# EasyEDA Pro project LT1568滤波器.eprj

# Schematic Schematic1
Board Name: Board1; Create Date: 2025-03-19; Page Name: P1; Project Name: LT1568滤波器; Schematic Name: Schematic1; Update Date: 2025-03-26; Company: 嘉立创EDA; Page Size: A4; Version: V1.0
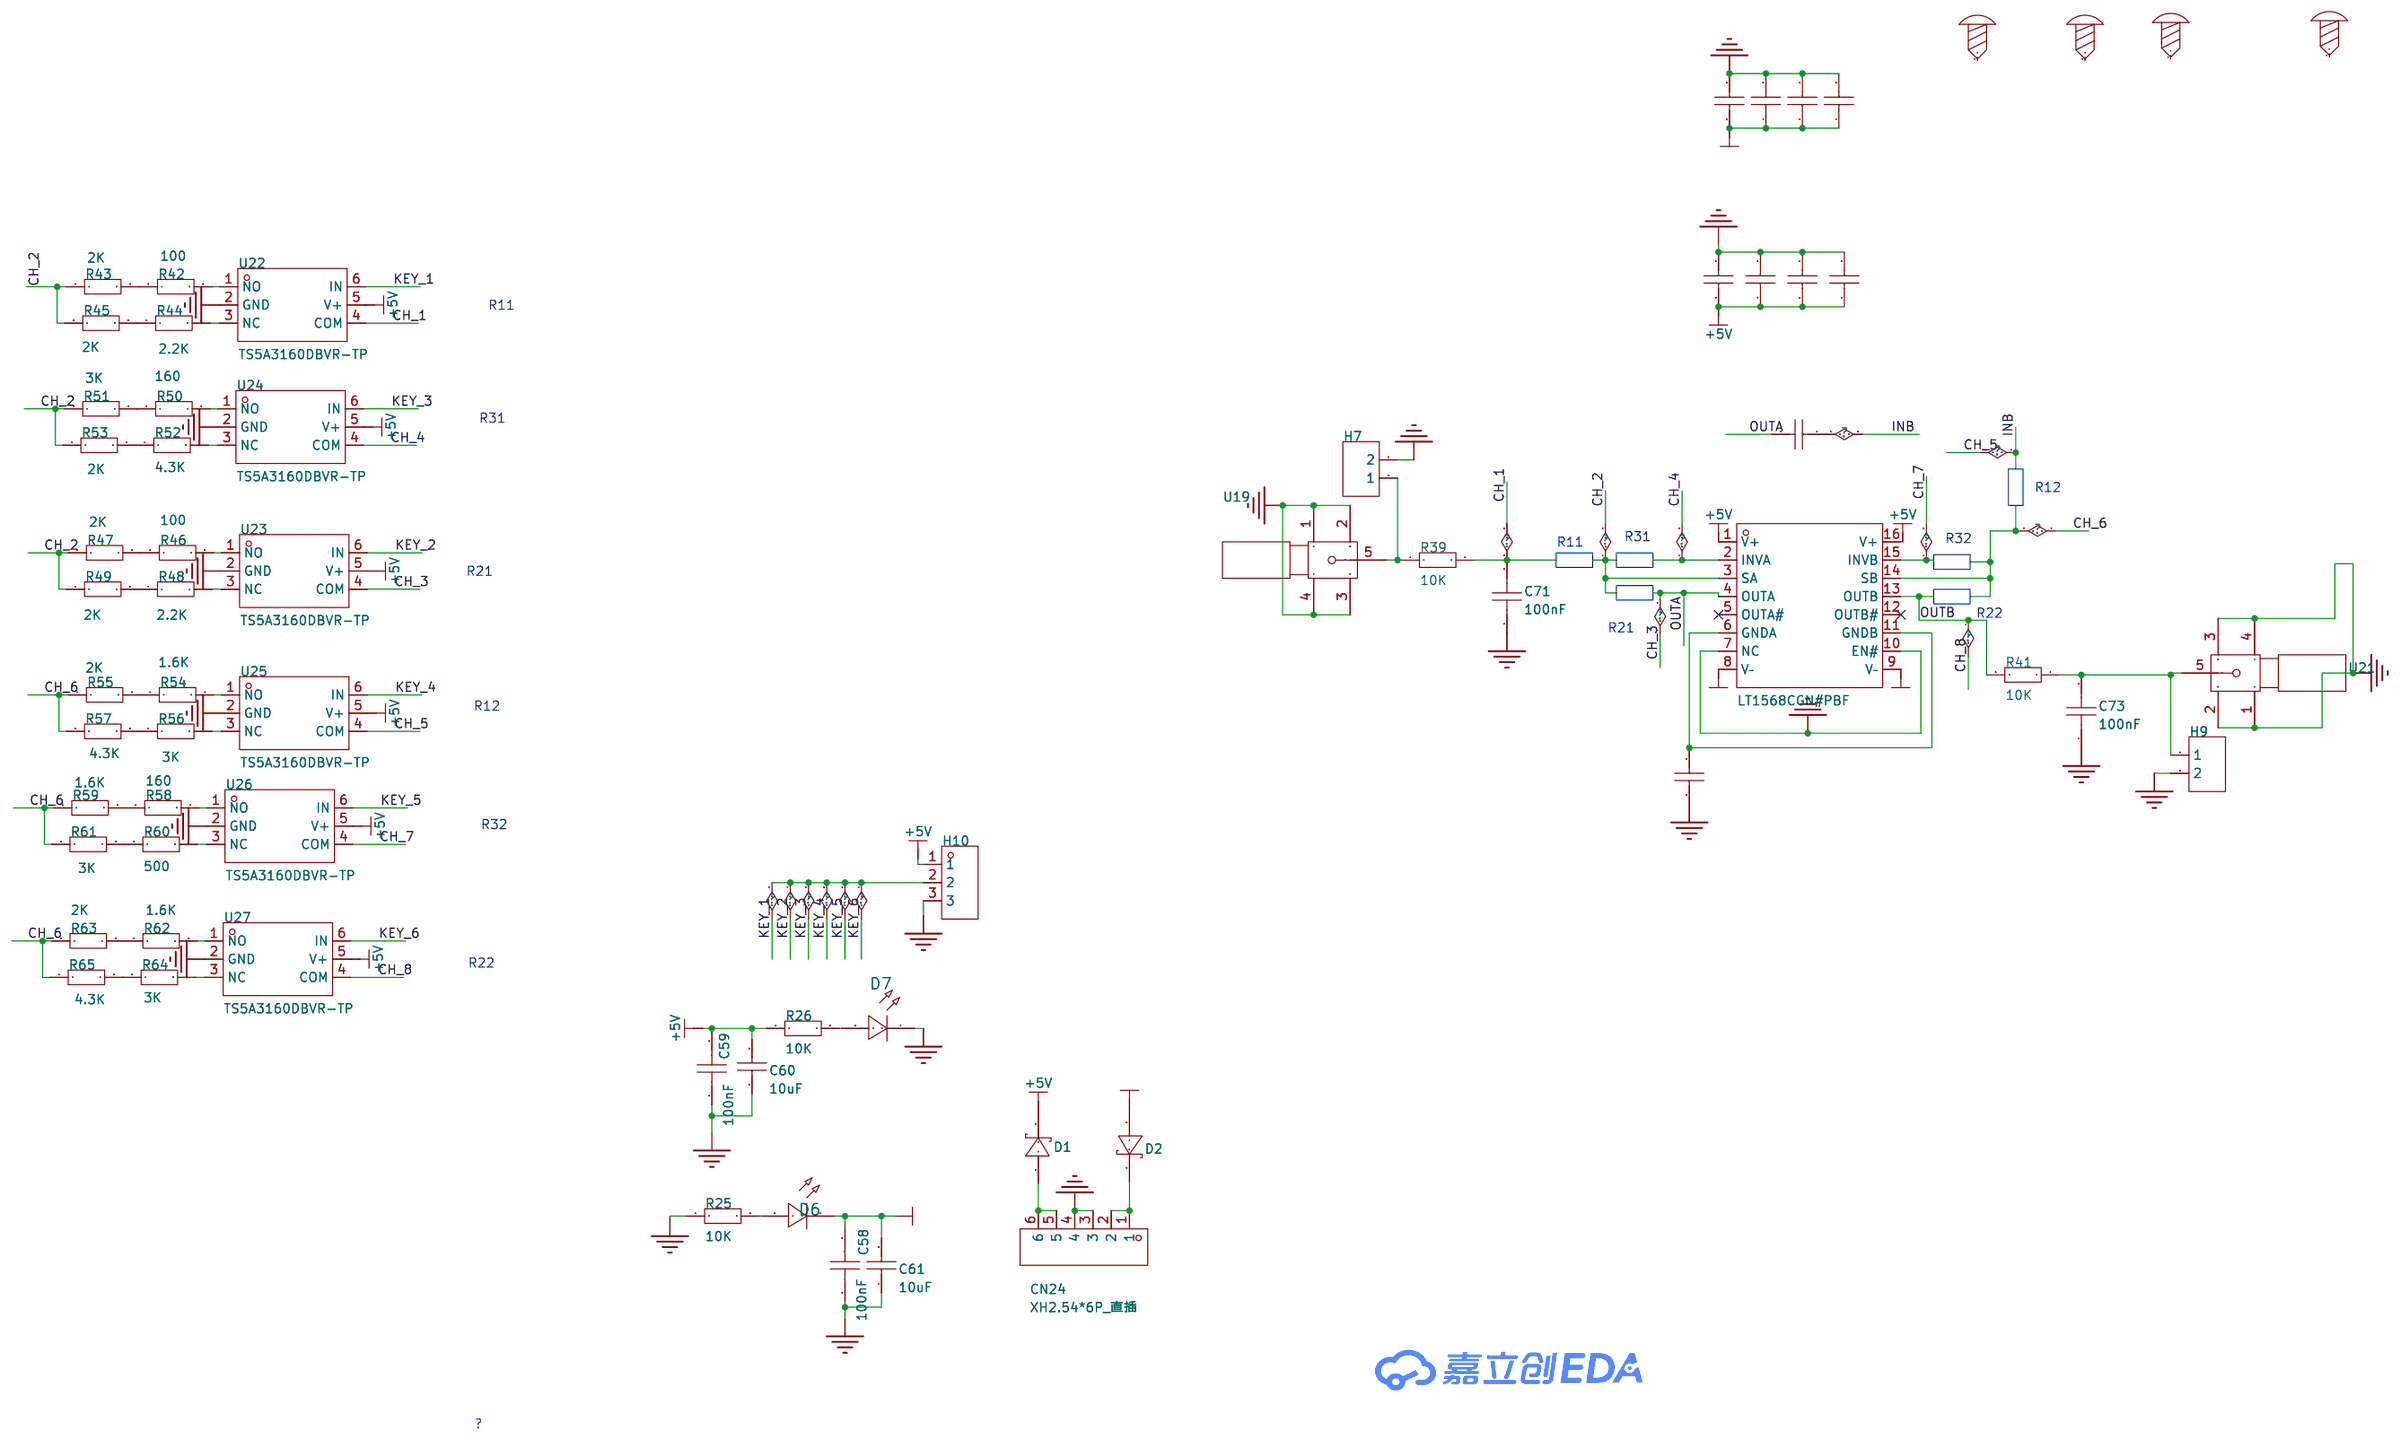
[diagram p0: schematic sheet]

## Parts
C58  100nF  [R0805]
C59  100nF  [R0805]
C60  10uF  [C1210]
C61  10uF  [C1210]
C62  104  [R0805]
C63  104  [R0805]
C64  104  [R0805]
C65  104  [R0805]
C66  104  [R0805]
C67  104  [R0805]
C68  104  [R0805]
C69  104  [R0805]
C70  104  [R0805]
C71  100nF  [R0805]
C73  100nF  [R0805]
C74  104  [R0805]
CN24  XH2.54*6P_直插  [CONN-TH_XH2.54-6P]
D1  SD103AWS  [SOD-323_L1.8-W1.3-LS2.5-RD]
D2  SD103AWS  [SOD-323_L1.8-W1.3-LS2.5-RD]
D6  -  [LED_0805]
D7  -  [LED_0805]
H7  -  [HDR-TH_2P-P2.54-V-F]
H9  -  [HDR-TH_2P-P2.54-V-F]
H10  -  [HDR-TH_3P-P2.54-V-F]
R25  10K  [R0805]
R26  10K  [R0805]
R39  10K  [R0805]
R41  10K  [R0805]
R42  100  [R0805]
R43  2K  [R0805]
R44  2.2K  [R0805]
R45  2K  [R0805]
R46  100  [R0805]
R47  2K  [R0805]
R48  2.2K  [R0805]
R49  2K  [R0805]
R50  160  [R0805]
R51  3K  [R0805]
R52  4.3K  [R0805]
R53  2K  [R0805]
R54  1.6K  [R0805]
R55  2K  [R0805]
R56  3K  [R0805]
R57  4.3K  [R0805]
R58  160  [R0805]
R59  1.6K  [R0805]
R60  500  [R0805]
R61  3K  [R0805]
R62  1.6K  [R0805]
R63  2K  [R0805]
R64  3K  [R0805]
R65  4.3K  [R0805]
SCREW1  -  [M3螺丝]
SCREW2  -  [M3螺丝]
SCREW3  -  [M3螺丝]
SCREW4  -  [M3螺丝]
U18  LT1568CGN#PBF  [SSOP-16_L4.9-W3.9-P0.64-LS6.0-BL]
U19  -  [SMA]
U21  -  [SMA]
U22  TS5A3160DBVR-TP  [SOT-23-6_L2.9-W1.6-P0.95-LS2.8-BR]
U23  TS5A3160DBVR-TP  [SOT-23-6_L2.9-W1.6-P0.95-LS2.8-BR]
U24  TS5A3160DBVR-TP  [SOT-23-6_L2.9-W1.6-P0.95-LS2.8-BR]
U25  TS5A3160DBVR-TP  [SOT-23-6_L2.9-W1.6-P0.95-LS2.8-BR]
U26  TS5A3160DBVR-TP  [SOT-23-6_L2.9-W1.6-P0.95-LS2.8-BR]
U27  TS5A3160DBVR-TP  [SOT-23-6_L2.9-W1.6-P0.95-LS2.8-BR]

## Library data of the parts
C58 C59 C71 C73 = CAP_0805: Supplier Footprint: 0805
C60 C61 = CL32B106KAJNNNE: 容值:10uF;精度:±10%;额定电压:25V;材质(温度系数):X7R;; LCSC Part Name: 10uF ±10% 25V; Supplier Part: C39232; Manufacturer: SAMSUNG(三星); Supplier Footprint: 1210; JLCPCB Part Class: 扩展库; Datasheet: https://atta.szlcsc.com/upload/public/pdf/source/20160218/1457707763339.pdf; Supplier: LCSC; Tolerance: ±10%; Voltage Rated: 25V; Temperature Coefficient: X7R
C62-C70 C74 = CL21C101JBANNNC: 容值:100pF;精度:±5%;额定电压:50V;材质(温度系数):C0G;; LCSC Part Name: 100pF ±5% 50V; Supplier Part: C1790; Manufacturer: SAMSUNG(三星); Supplier Footprint: 0805; JLCPCB Part Class: 基础库; Datasheet: https://atta.szlcsc.com/upload/public/pdf/source/20160218/1457707763339.pdf; Supplier: LCSC; Tolerance: ±5%; Voltage Rated: 50V; Temperature Coefficient: C0G
CN24 = XH2.54*6P_直插: Supplier Part: C9900008614; Supplier Footprint: XH2.54_6P; JLCPCB Part Class: 扩展库; Supplier: LCSC
D1 D2 = SD103AWS_C181207: 正向压降(Vf):600mV@200mA;直流反向耐压(Vr):40V;整流电流:350mA;; LCSC Part Name: 电压:40V 电流:350mA 丝印S4; Supplier Part: C181207; Manufacturer: Hottech(合科泰); Supplier Footprint: SOD-323; JLCPCB Part Class: 扩展库; Datasheet: https://atta.szlcsc.com/upload/public/pdf/source/20240513/4691873FBB9173EFBCF4C6FD4BBA1025.pdf; Supplier: LCSC; Forward Voltage (Vf@If): 600mV@200mA; Reverse Voltage (Vr): 40V; Rectified Current: 350mA
D6 D7 = LED_0805-R: Supplier Footprint: 0805
H7 H9 = HDR-F_2.54_1x2P: Supplier Part: C49661; Supplier Footprint: 插件
H10 = HDR-F_2.54_1x3P: Supplier Part: C541850; Supplier Footprint: 插件
R25 R26 R39 R41-R65 = Res_0805: Supplier Footprint: 0805
SCREW1-SCREW4 = M3螺丝: Supplier Footprint: 插件
U18 = LT1568CGN#PBF: 极低噪声、高频有源 RC 滤波器单元式部件; Supplier Part: C579774; Manufacturer: ADI(亚德诺); Supplier Footprint: SSOP-16-150mil; JLCPCB Part Class: 扩展库; Datasheet: https://atta.szlcsc.com/upload/public/pdf/source/20221018/50C72796FB50C385BED47E5C4760EF7E.pdf; Supplier: LCSC
U19 U21 = SMA
U22-U27 = TS5A3160DBVR-TP: Supplier Part: C42411033; Manufacturer: TECH PUBLIC(台舟); Supplier Footprint: SOT-23-6; Datasheet: https://atta.szlcsc.com/upload/public/pdf/source/20241230/E131AA95D5A7F1B04855F47B4BFD49CC.pdf; Supplier: LCSC

## Nets
+5V: C59.2 C60.2 C66.1 C67.2 C68.1 C69.2 D1.1(C) H10.1 R26.1 U18.1(V+) U18.16(V+) U22.5(V+) U23.5(V+) U24.5(V+) U25.5(V+) U26.5(V+) U27.5(V+)
-5V: C58.2 C61.2 C62.1 C63.2 C64.1 C65.2 D2.2(A) D6.1(C) U18.8(V–) U18.9(V–)
GND: C58.1 C59.1 C60.1 C61.1 C62.2 C63.1 C64.2 C65.1 C66.2 C67.1 C68.2 C69.1 C70.1 C71.1 C73.1 CN24.3 CN24.4 D7.1(C) H7.2 H9.2 H10.3 R25.1 U18.7(NC) U18.10(EN#) U19.1 U19.2 U19.3 U19.4 U21.1 U21.2 U21.3 U21.4 U22.2(GND) U23.2(GND) U24.2(GND) U25.2(GND) U26.2(GND) U27.2(GND)
CH_1: C71.2 R39.2 U22.4(COM)
CH_2: R43.1 R45.1 R47.1 R49.1 R51.1 R53.1 U18.3(SA)
CH_3: C74.2 U18.4(OUTA) U23.4(COM)
CH_4: U18.2(INVA) U24.4(COM)
CH_5: C74.1 U25.4(COM)
CH_6: R55.1 R57.1 R59.1 R61.1 R63.1 R65.1 U18.14(SB)
CH_7: U18.15(INVB) U26.4(COM)
CH_8: R41.2 U18.13(OUTB) U27.4(COM)
KEY_1: H10.2 U22.6(IN) U23.6(IN) U24.6(IN) U25.6(IN) U26.6(IN) U27.6(IN)
$1N1595: C73.2 H9.1 R41.1 U21.5
$1N1677: C70.2 U18.6(GNDA) U18.11(GNDB)
$1N1691: R42.1 R43.2
$1N1718: H7.1 R39.1 U19.5
$1N1753: R42.2 U22.1(NO)
$1N1803: R44.1 R45.2
$1N1805: R44.2 U22.3(NC)
$1N2057: R46.1 R47.2
$1N2064: R48.1 R49.2
$1N2066: R48.2 U23.3(NC)
$1N2076: R46.2 U23.1(NO)
$1N2243: R50.1 R51.2
$1N2250: R52.1 R53.2
$1N2252: R52.2 U24.3(NC)
$1N2262: R50.2 U24.1(NO)
$1N2429: R54.1 R55.2
$1N2436: R56.1 R57.2
$1N2438: R56.2 U25.3(NC)
$1N2448: R54.2 U25.1(NO)
$1N2615: R58.1 R59.2
$1N2622: R60.1 R61.2
$1N2624: R60.2 U26.3(NC)
$1N2634: R58.2 U26.1(NO)
$1N2801: R62.1 R63.2
$1N2808: R64.1 R65.2
$1N2810: R64.2 U27.3(NC)
$1N2820: R62.2 U27.1(NO)
$1N3435: D6.2(A) R25.2
$1N3437: D7.2(A) R26.2
$1N3585: CN24.1 CN24.2 D2.1(C)
$1N3588: CN24.5 CN24.6 D1.2(A)

Not connected (* = marked no-connect by the designer): SCREW1 1; SCREW2 1; SCREW3 1; SCREW4 1; U18 5(OUTA#)* 12(OUTB#)*

## Notes on the sheet
- R11
- R31
- R12
- R11
- R31
- R32
- R21
- R22
- R21
- R12
- R32
- R22

# Board PCB1
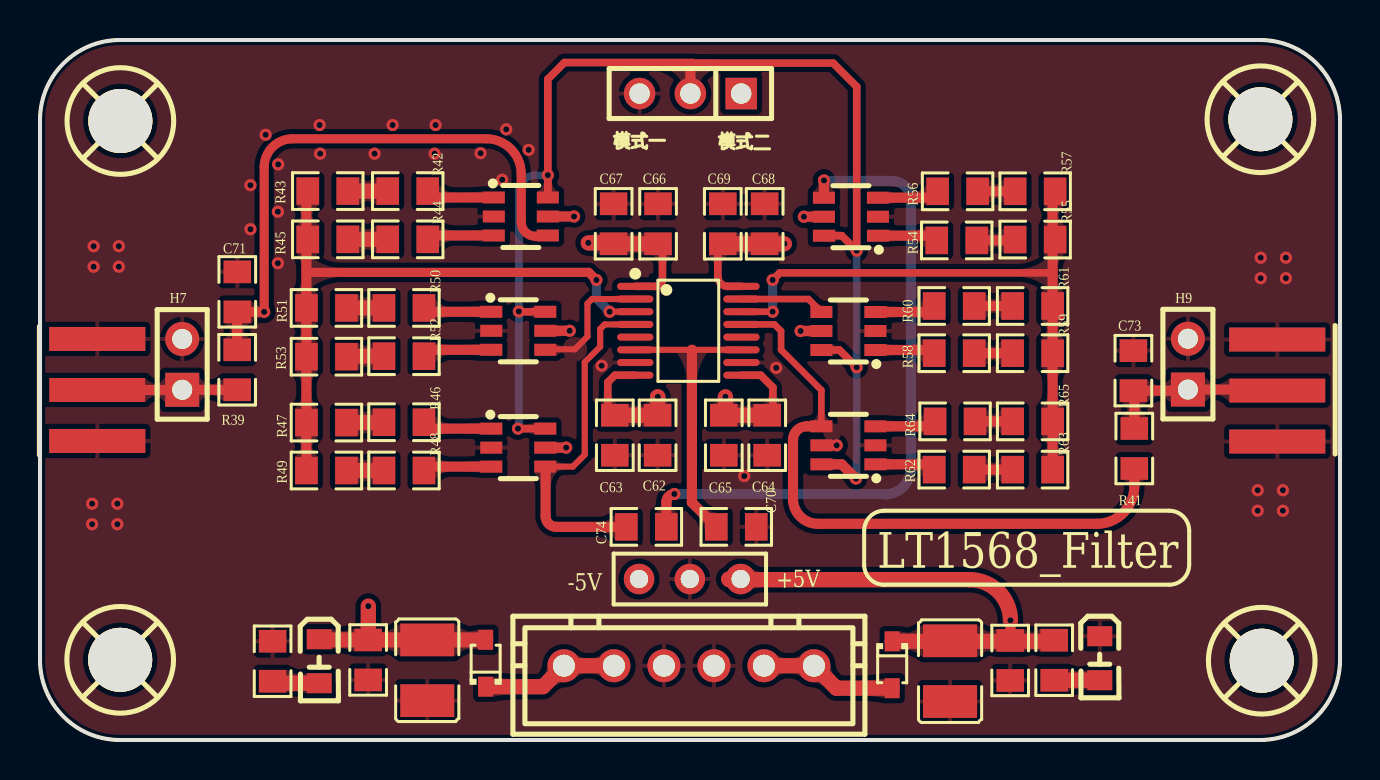
[diagram p1: board, top side]
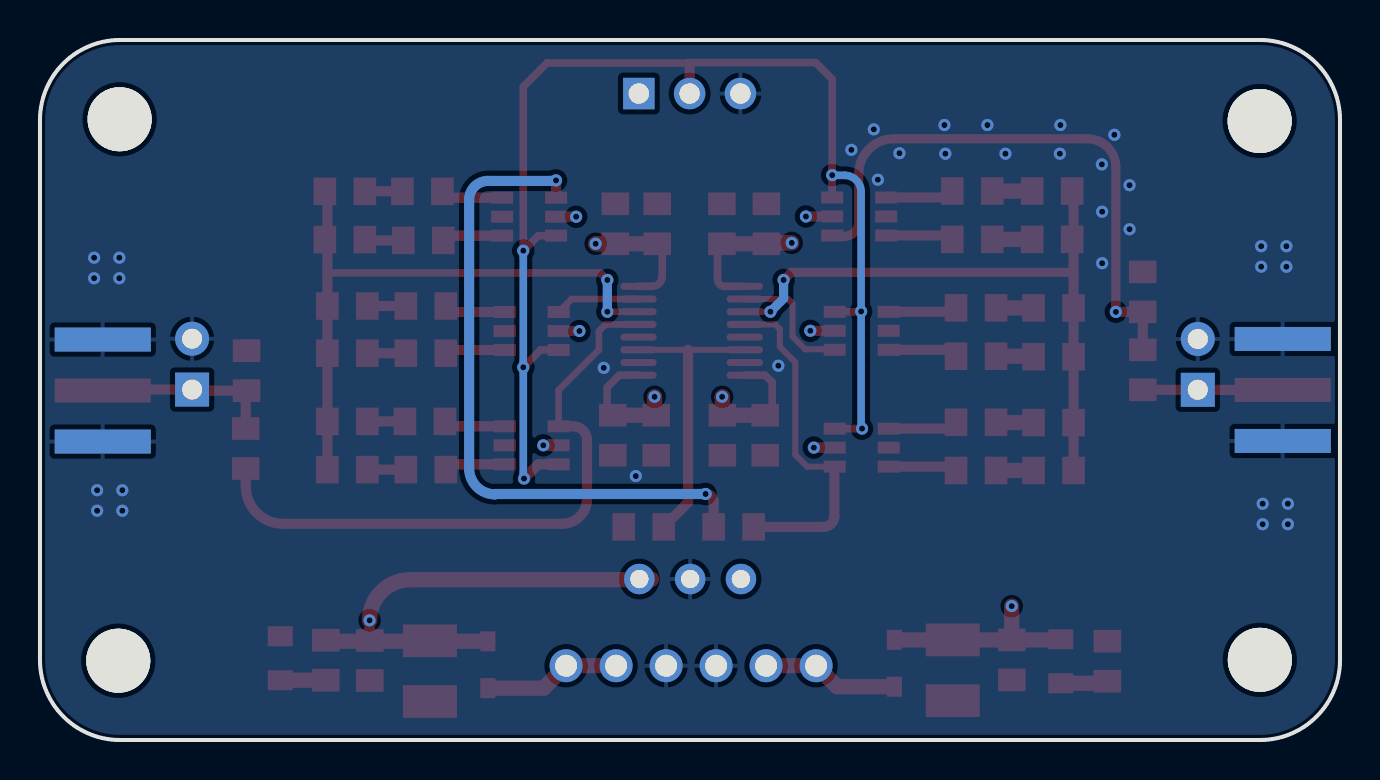
[diagram p2: board, bottom side, seen from below]

Outline 65 x 35 mm; copper layers: Top Layer, Inner1, Inner2, Bottom Layer. Coordinates in mm from the lower left corner of the outline.
Outline path: 0,31 arc(1.17,33.83) 4,35 61,35 arc(63.83,33.83) 65,31 65,4 arc(63.83,1.17) 61,0 4,0 arc(1.17,1.17) 0,4 0,31
Stack: Top Layer 0.035mm 外层铜厚1oz / Dielectric1 0.2104mm 7628 RC49% 8.6mil / Inner1 0.0152mm 内层铜厚 / Dielectric2 1.065mm 1.1mm H/HOZ Copper / Inner2 0.0152mm 内层铜厚 / Dielectric3 0.2104mm 7628 RC49% 8.6mil / Bottom Layer 0.035mm 外层铜厚1oz

## Design rules (mm)
template: 自定义配置
spacing copperThickness1oz (default): track to track 0.102, other pairs 0.152 to 0.3
spacing copperThickness2oz: track to track 0.203, other pairs 0.152 to 0.3
track width copperThickness1oz (default): min 0.127, default 0.508, max 2.54
track width copperThickness2oz: min 0.203, default 0.254, max 2.54
differential pair differentialPair (default): width min 0.127, default 0.254, max 2.54; gap min 0.152, default 0.152
via viaSize (default): diameter min 0.5, default 0.61, max 10; hole min 0.3, default 0.305, max 6.299

## Placement (name value [footprint] x y rotation side)
C58  100nF  [R0805#2]  16.41 4.11 90 top
C59  100nF  [R0805#2]  48.51 4.09 90 top
C60  10uF  [C1210]  45.5 3.44 90 top
C61  10uF  [C1210]  19.36 3.49 90 top
C62  104  [R0805#2]  30.88 15.13 270 top
C63  104  [R0805#2]  28.74 15.35 90 top
C64  104  [R0805#2]  36.36 15.13 270 top
C65  104  [R0805#2]  34.19 15.35 90 top
C66  104  [R0805#2]  30.9 25.92 90 top
C67  104  [R0805#2]  28.68 25.7 270 top
C68  104  [R0805#2]  36.23 25.92 90 top
C69  104  [R0805#2]  34.14 25.7 270 top
C70  104  [R0805#2]  34.7 10.66 180 top
C71  100nF  [R0805#2]  9.86 22.3 270 top
C73  100nF  [R0805#2]  54.67 18.36 270 top
C74  104  [R0805#2]  30.21 10.66 180 top
CN24  XH2.54*6P_直插  [CONN-TH_XH2.54-6P]  32.44 3.71 0 top
D1  SD103AWS  [SOD-323_L1.8-W1.3-LS2.5-RD]  42.61 3.76 270 top
D2  SD103AWS  [SOD-323_L1.8-W1.3-LS2.5-RD]  22.28 3.84 90 top
D6  -  [LED_0805]  13.96 3.89 270 top
D7  -  [LED_0805]  52.98 4.04 270 top
H7  -  [HDR-TH_2P-P2.54-V-F]  7.11 18.78 90 top
H9  -  [HDR-TH_2P-P2.54-V-F]  57.4 18.79 90 top
H10  -  [HDR-TH_3P-P2.54-V-F]  32.52 32.32 180 top
NOREF  -  [Pad_e4094]  32.49 8.05 0 top
NOREF#2  -  [Pad_e4095]  35.03 8.05 0 top
NOREF#3  -  [Pad_e4093]  29.95 8.05 0 top
R25  10K  [R0805]  11.63 3.94 270 top
R26  10K  [R0805]  50.71 3.99 270 top
R39  10K  [R0805]  9.86 18.51 90 top
R41  10K  [R0805]  54.71 14.58 270 top
R42  100  [R0805]  18.39 27.45 0 top
R43  2K  [R0805]  14.39 27.45 0 top
R44  2.2K  [R0805]  18.39 25.03 0 top
R45  2K  [R0805]  14.39 25.03 0 top
R46  100  [R0805]  18.2 15.89 0 top
R47  2K  [R0805]  14.32 15.87 0 top
R48  2.2K  [R0805]  18.2 13.48 0 top
R49  2K  [R0805]  14.32 13.48 0 top
R50  160  [R0805]  18.2 21.6 0 top
R51  3K  [R0805]  14.32 21.6 0 top
R52  4.3K  [R0805]  18.2 19.19 0 top
R53  2K  [R0805]  14.32 19.17 0 top
R54  1.6K  [R0805]  45.84 24.98 180 top
R55  2K  [R0805]  49.76 25.02 180 top
R56  3K  [R0805]  45.88 27.43 180 top
R57  4.3K  [R0805]  49.76 27.43 180 top
R58  160  [R0805]  45.71 19.34 180 top
R59  1.6K  [R0805]  49.63 19.34 180 top
R60  500  [R0805]  45.71 21.7 180 top
R61  3K  [R0805]  49.63 21.7 180 top
R62  1.6K  [R0805]  45.71 13.52 180 top
R63  2K  [R0805]  49.63 13.52 180 top
R64  3K  [R0805]  45.75 15.93 180 top
R65  4.3K  [R0805]  49.63 15.93 180 top
SCREW1  -  [M3螺丝]  4.02 30.95 0 top
SCREW2  -  [M3螺丝]  4.01 4.01 0 top
SCREW3  -  [M3螺丝]  61.02 31.04 0 top
SCREW4  -  [M3螺丝]  61.09 3.96 0 top
U18  LT1568CGN#PBF  [SSOP-16_L4.9-W3.9-P0.64-LS6.0-BL]  32.42 20.46 270 top
U19  -  [SMA]  -0.95 11.64 0 top
U21  -  [SMA]  65.67 23.33 180 top
U22  TS5A3160DBVR-TP  [SOT-23-6_L2.9-W1.6-P0.95-LS2.8-BR]  24.04 26.18 180 top
U23  TS5A3160DBVR-TP  [SOT-23-6_L2.9-W1.6-P0.95-LS2.8-BR]  23.91 14.62 180 top
U24  TS5A3160DBVR-TP  [SOT-23-6_L2.9-W1.6-P0.95-LS2.8-BR]  23.91 20.46 180 top
U25  TS5A3160DBVR-TP  [SOT-23-6_L2.9-W1.6-P0.95-LS2.8-BR]  40.55 26.16 0 top
U26  TS5A3160DBVR-TP  [SOT-23-6_L2.9-W1.6-P0.95-LS2.8-BR]  40.42 20.45 0 top
U27  TS5A3160DBVR-TP  [SOT-23-6_L2.9-W1.6-P0.95-LS2.8-BR]  40.42 14.73 0 top

## Footprints (pads in the part's own frame, mm; a bottom-side part is the same pattern mirrored in y, then rotated)
C1210
  rect 1.635x2.7 smd: 1(-1.518,0) 2(1.518,0)
CONN-TH_XH2.54-6P
  round 1.65 hole 1.1: 1(-6.25,0) 2(-3.75,0) 3(-1.25,0) 4(1.25,0) 5(3.75,0) 6(6.25,0)
HDR-TH_2P-P2.54-V-F
  rect 1.7x1.7 hole 1: 1(-1.27,0)
  round 1.7 hole 1: 2(1.27,0)
HDR-TH_3P-P2.54-V-F
  rect 1.575x1.575 hole 1.02: 1(-2.54,0)
  round 1.575 hole 1.02: 2(0,0) 3(2.54,0)
LED_0805
  rect 1x1.25 smd: 1(-1.15,0.005) 2(1.05,0.005)
M3螺丝
  round 3.2 hole 3.2: 1(0,0)
Pad_e4093
  round 1.524 hole 0.914: 1(0,0)
Pad_e4094
  round 1.524 hole 0.914: 2(0,0)
Pad_e4095
  round 1.524 hole 0.914: 3(0,0)
R0805
  rect 1.133x1.377 smd: 1(-1,0) 2(1,0)
R0805#2
  rect 1.133x1.377 smd: 1(-1.111,0) 2(0.889,0)
SMA
  rect 4.8x1.2 smd: 1(3.81,8.412) 2(3.81,3.312) 5(3.81,5.862)
  rect 4.8x1.2 smd far side: 3(3.81,3.312) 4(3.81,8.412)
SOD-323_L1.8-W1.3-LS2.5-RD
  rect 1x0.75 smd: 1(-1.173,0) 2(1.173,0)
SOT-23-6_L2.9-W1.6-P0.95-LS2.8-BR
  rect 1.1x0.6 smd: 1(1.35,-0.95) 2(1.35,0) 3(1.35,0.95) 4(-1.35,0.95) 5(-1.35,0) 6(-1.35,-0.95)
SSOP-16_L4.9-W3.9-P0.64-LS6.0-BL
  oval 0.355x1.815 smd: 1(-2.223,-2.655) 2(-1.587,-2.655) 3(-0.953,-2.655) 4(-0.318,-2.655) 5(0.318,-2.655) 6(0.953,-2.655) 7(1.587,-2.655) 8(2.223,-2.655) 9(2.223,2.655) 10(1.587,2.655) 11(0.953,2.655) 12(0.318,2.655) 13(-0.318,2.655) 14(-0.953,2.655) 15(-1.587,2.655) 16(-2.223,2.655)

## Nets
As in the schematic, except:
+5V: C59.2 C60.2 C66.1 C67.2 C68.1 C69.2 D1.1 H10.1 NOREF#2.3 R26.1 U18.1 U18.16 U22.5 U23.5 U24.5 U25.5 U26.5 U27.5
-5V: C58.2 C61.2 C62.1 C63.2 C64.1 C65.2 D2.2 D6.1 NOREF#3.1 U18.8 U18.9
GND: C58.1 C59.1 C60.1 C61.1 C62.2 C63.1 C64.2 C65.1 C66.2 C67.1 C68.2 C69.1 C70.1 C71.1 C73.1 CN24.3 CN24.4 D7.1 H7.2 H9.2 H10.3 NOREF.2 R25.1 U18.7 U18.10 U19.1 U19.2 U19.3 U19.4 U21.1 U21.2 U21.3 U21.4 U22.2 U23.2 U24.2 U25.2 U26.2 U27.2

Pads without a net: SCREW1 1; SCREW2 1; SCREW3 1; SCREW4 1; U18 5 12

## Via types
v1: diameter 0.61, hole 0.305, Top Layer to Bottom Layer, 60 vias

## Routing (per net, layer and track width the routed paths; a pad name or vN(x,y) marks a point on that pad's centre or on a via; arc(x,y) is an arc through that point)
+5V: length 44.2
  Top Layer w0.381: 35.08,22.68 34.39,22.68 arc(34.04,22.83) 33.89,23.18 33.89,24.56 arc(33.96,24.74) C69.2 ; 29.77,22.68 30.78,22.68 arc(31.02,22.78) 31.12,23.03 31.12,24.86 arc(31.08,24.96) 30.97,25.01
  Top Layer w0.508: v1(48.52,5.98) 48.52,4.99 arc(48.52,4.98) C59.2 ; U26.5 v1(38.03,20.45) ; U25.5 v1(38.19,26.16) ; U23.5 v1(26.31,14.62) ; U22.5 v1(26.7,26.18) ; U27.5 v1(39.83,14.73) ; U24.5 v1(26.48,20.46)
  Top Layer w0.762: C66.1 C67.2 28.64,24.86 v1(27.41,24.86) ; v1(37.22,24.81) C68.1 C69.2 ; R26.1 50.66,4.94 D1.1 ; v1(48.52,5.98) arc(47.93,7.42) 46.49,8.02 34.47,8.02 arc(34.44,8.02) 34.43,8.05
-5V: length 22.9
  Top Layer w0.381: 35.08,18.24 36.04,18.24 36.64,17.63 36.64,16.52 36.36,16.24 ; C63.2 28.39,16.59 28.39,17.89 28.74,18.24 29.77,18.24
  Top Layer w0.762: 16.41,5 14,5 D6.1 ; 16.41,5 16.41,5.01 v1(16.41,6.69) ; 16.41,5 C61.2 22.27,5 22.28,5.01 ; 36.36,16.24 C65.2 34.27,16.32 v1(34.27,17.16) ; C63.2 30.88,16.24 30.88,17.15 v1(30.89,17.16)
GND:
  vias: v1(2.68,24.69) v1(2.68,23.66) v1(2.61,11.81) v1(2.61,10.79) v1(3.87,11.81) v1(3.87,10.79) v1(3.94,24.69) v1(3.94,23.66) v1(10.52,27.74) v1(10.52,25.54) v1(11.28,30.26) v1(11.89,26.42) v1(11.89,23.84) v1(11.91,28.78) v1(13.98,30.75) v1(14.01,29.31) v1(16.73,29.31) v1(17.63,30.75) v1(19.78,30.75) v1(19.73,29.31) v1(22.03,29.34) v1(23.11,28.02) v1(23.31,30.53) v1(24.43,29.51) v1(28.08,18.71) v1(35.21,13.2) v1(36.81,18.61) v1(60.88,12.49) v1(60.88,11.46) v1(61.03,24.11) v1(61.03,23.09) v1(62.14,12.49) v1(62.14,11.46) v1(62.29,24.11) v1(62.29,23.09)
CH_1: length 29.3
  Top Layer w0.457: v1(11.21,21.41) 11.21,28.64 arc(11.62,29.65) 12.63,30.06 22.31,30.06 arc(23.55,29.55) 24.06,28.31 24.06,25.9 arc(24.27,25.39) 24.77,25.19 25.35,25.19 arc(25.38,25.2) U22.4
  Top Layer w0.508: R39.2 9.86,21.4 C71.2 v1(11.21,21.41)
CH_2: length 31.8
  Top Layer w0.305: 29.77,21.41 v1(28.48,21.41)
  Top Layer w0.457: 13.32,23.38 27.44,23.38 v1(27.82,23)
  Top Layer w0.508: R43.1 13.32,27.38 R51.1 R53.1 R47.1 R49.1
  Bottom Layer w0.457: v1(27.82,23) 27.82,22.07 v1(28.48,21.41)
CH_3: length 17.5
  Top Layer w0.305: U23.4 26.64,13.67 27.24,14.26 27.24,18.89 28.01,19.66 28.01,20.55 28.23,20.78 29.77,20.78
  Top Layer w0.508: C74.2 25.81,10.66 arc(25.44,10.81) 25.28,11.19 25.28,13.65 arc(25.27,13.66) U23.4
CH_4: length 6.5
  Top Layer w0.305: 29.77,22.05 27.6,22.05 27.37,21.82 27.37,20.17 26.74,19.54 25.29,19.54 U24.4
CH_5: length 33.6
  Top Layer w0.508: v1(39.2,27.98) 39.2,27.12 arc(39.2,27.12) U25.4 ; C74.1 31.32,11.9 arc(31.44,12.18) v1(31.72,12.3)
  Bottom Layer w0.508: v1(31.72,12.3) 42.23,12.3 42.25,12.28 arc(43.16,12.66) 43.54,13.58 43.54,27.01 arc(43.27,27.68) 42.6,27.95 39.22,27.95 arc(39.21,27.96) v1(39.2,27.98)
CH_6: length 31.3
  Top Layer w0.33: 35.08,21.41 v1(36.63,21.41)
  Top Layer w0.381: v1(36.63,23) 36.99,23.36 50.63,23.36
  Top Layer w0.508: R63.1 R65.1 R59.1 R61.1 50.63,27.31 R57.1
  Bottom Layer w0.457: v1(36.63,23) 36.63,21.41
CH_7: length 4.3
  Top Layer w0.33: U26.4 38.42,22.05 35.08,22.05
CH_8: length 32.2
  Top Layer w0.33: U27.4 39.07,17.49 37.05,19.51 37.05,20.45 36.72,20.78 35.08,20.78
  Top Layer w0.508: U27.4 38.34,15.69 arc(37.85,15.49) 37.65,15 37.65,12.05 arc(38.01,11.17) 38.89,10.81 52.84,10.81 arc(54.17,11.36) 54.71,12.69 R41.2
KEY_1: length 67
  Top Layer w0.381: U24.6 23.96,21.41 v1(23.94,21.43) ; U25.6 40.09,25.21 v1(40.84,24.47) 40.84,32.67 39.66,33.85 32.64,33.85 32.61,33.87 26.22,33.87 25.39,33.04 v1(25.39,28.24) ; v1(23.9,15.57) U23.6 ; U26.6 39.97,19.5 v1(40.84,18.63) ; v1(25.39,28.24) U22.6 v1(25.39,28.24)
  Top Layer w0.508: v1(40.8,13.07) 40.08,13.78 U27.6 ; H10.2 32.52,33.78
  Bottom Layer w0.381: v1(40.8,13.07) 40.84,13.11 v1(40.84,18.63) v1(40.84,24.47) ; v1(23.9,15.57) 23.94,15.61 v1(23.94,21.43) 23.94,27.41 arc(24.19,27.99) 24.77,28.23 25.38,28.23 arc(25.39,28.24) v1(25.39,28.24)
$1N1595: length 9.2
  Top Layer w0.508: R41.1 54.71,17.42 arc(54.7,17.45) C73.2 57.34,17.47 arc(57.38,17.48) H9.1 61.81,17.52 arc(61.85,17.51) U21.5
$1N1677: length 14.7
  Top Layer w0.305: 35.08,19.51 29.77,19.51
  Top Layer w0.508: C70.2 32.59,11.88 32.59,19.5 32.6,19.51
$1N1691: length 2
  Top Layer w0.762: 17.33,27.45 15.34,27.45
$1N1718: length 7
  Top Layer w0.508: 9.86,17.51 H7.1 7.1,17.5 U19.5
$1N1753: length 3.4
  Top Layer w0.508: 19.33,27.45 19.65,27.13 22.64,27.13
$1N1803: length 2
  Top Layer w0.762: R44.1 R45.2
$1N1805: length 3.4
  Top Layer w0.508: R44.2 19.58,25.23 U22.3
$1N2057: length 1.9
  Top Layer w0.762: R46.1 17.18,15.87 R47.2
$1N2064: length 1.9
  Top Layer w0.762: R48.1 R49.2
$1N2066: length 3.4
  Top Layer w0.508: R48.2 19.39,13.67 U23.3
$1N2076: length 3.5
  Top Layer w0.508: R46.2 19.52,15.57 U23.1
$1N2243: length 1.9
  Top Layer w0.762: R50.1 R51.2
$1N2250: length 1.9
  Top Layer w0.762: R52.1 15.32,19.19
$1N2252: length 3.5
  Top Layer w0.508: R52.2 19.52,19.51 U24.3
$1N2262: length 3.4
  Top Layer w0.508: U24.1 19.39,21.41 R50.2
$1N2429: length 1.9
  Top Layer w0.508: R55.2 48.71,24.98 R54.1
$1N2436: length 1.9
  Top Layer w0.508: 46.83,27.43 48.71,27.43
$1N2438: length 3.1
  Top Layer w0.508: 44.83,27.43 44.51,27.11 41.84,27.11
$1N2448: length 3
  Top Layer w0.508: U25.1 44.6,25.21 R54.2
$1N2615: length 1.9
  Top Layer w0.508: R58.1 R59.2
$1N2622: length 1.9
  Top Layer w0.508: R60.1 R61.2
$1N2624: length 3.1
  Top Layer w0.508: U26.3 44.41,21.4 R60.2
$1N2634: length 3
  Top Layer w0.508: R58.2 44.55,19.5 U26.1
$1N2801: length 1.9
  Top Layer w0.508: R62.1 R63.2
$1N2808: length 1.9
  Top Layer w0.508: R64.1 R65.2
$1N2810: length 3.1
  Top Layer w0.508: U27.3 44.51,15.68 R64.2
$1N2820: length 3.1
  Top Layer w0.508: R62.2 44.44,13.78 U27.1
$1N3435: length 2.4
  Top Layer w0.762: D6.2 11.73,2.84 R25.2
$1N3437: length 2.3
  Top Layer w0.762: R26.2 D7.2
$1N3585: length 6.8
  Top Layer w0.762: CN24.2 CN24.1 25.15,2.67 D2.1
$1N3588: length 6.9
  Top Layer w0.762: D1.2 39.82,2.59 CN24.6 CN24.5

## Copper pours and planes (outline as drawn; the poured copper is in the pictures)
+5V on Inner2: 25.57,33.66 40.25,33.66 40.25,6.96 25.57,6.96
-5V on Inner2: 15.53,17.57 36.96,17.57 36.96,6.21 15.53,6.21
GND on Top Layer: -9.12,46.84 76.16,46.84 76.16,-11.14 -9.12,-11.14
GND on Bottom Layer: -7.92,50.12 75.26,50.12 75.26,-14.39 -7.92,-14.39
GND on Inner1: 0.26,34.74 64.74,34.74 64.74,0.26 0.26,0.26
GND on Inner2: 0.26,34.74 64.74,34.74 64.74,0.26 0.26,0.26

Small or netless copper shapes (teardrops, artwork), in the pictures only: 176 on Top Layer, 14 on Bottom Layer, 24 on Inner1, 32 on Inner2

## Text on the board
Top Silkscreen Layer: 模式一 | 模式二 | +5V | -5V | LT1568_Filter
